# EasyEDA Pro project ProProject_stm32_2023-08-13(1).epro

# Schematic stm32
Create Date: 2023-08-06; Page Name: P1; Project Name: stm32; Schematic Name: stm32; Update Date: 2023-08-10; Company: 嘉立创EDA; Page Size: A4; Version: V1.0
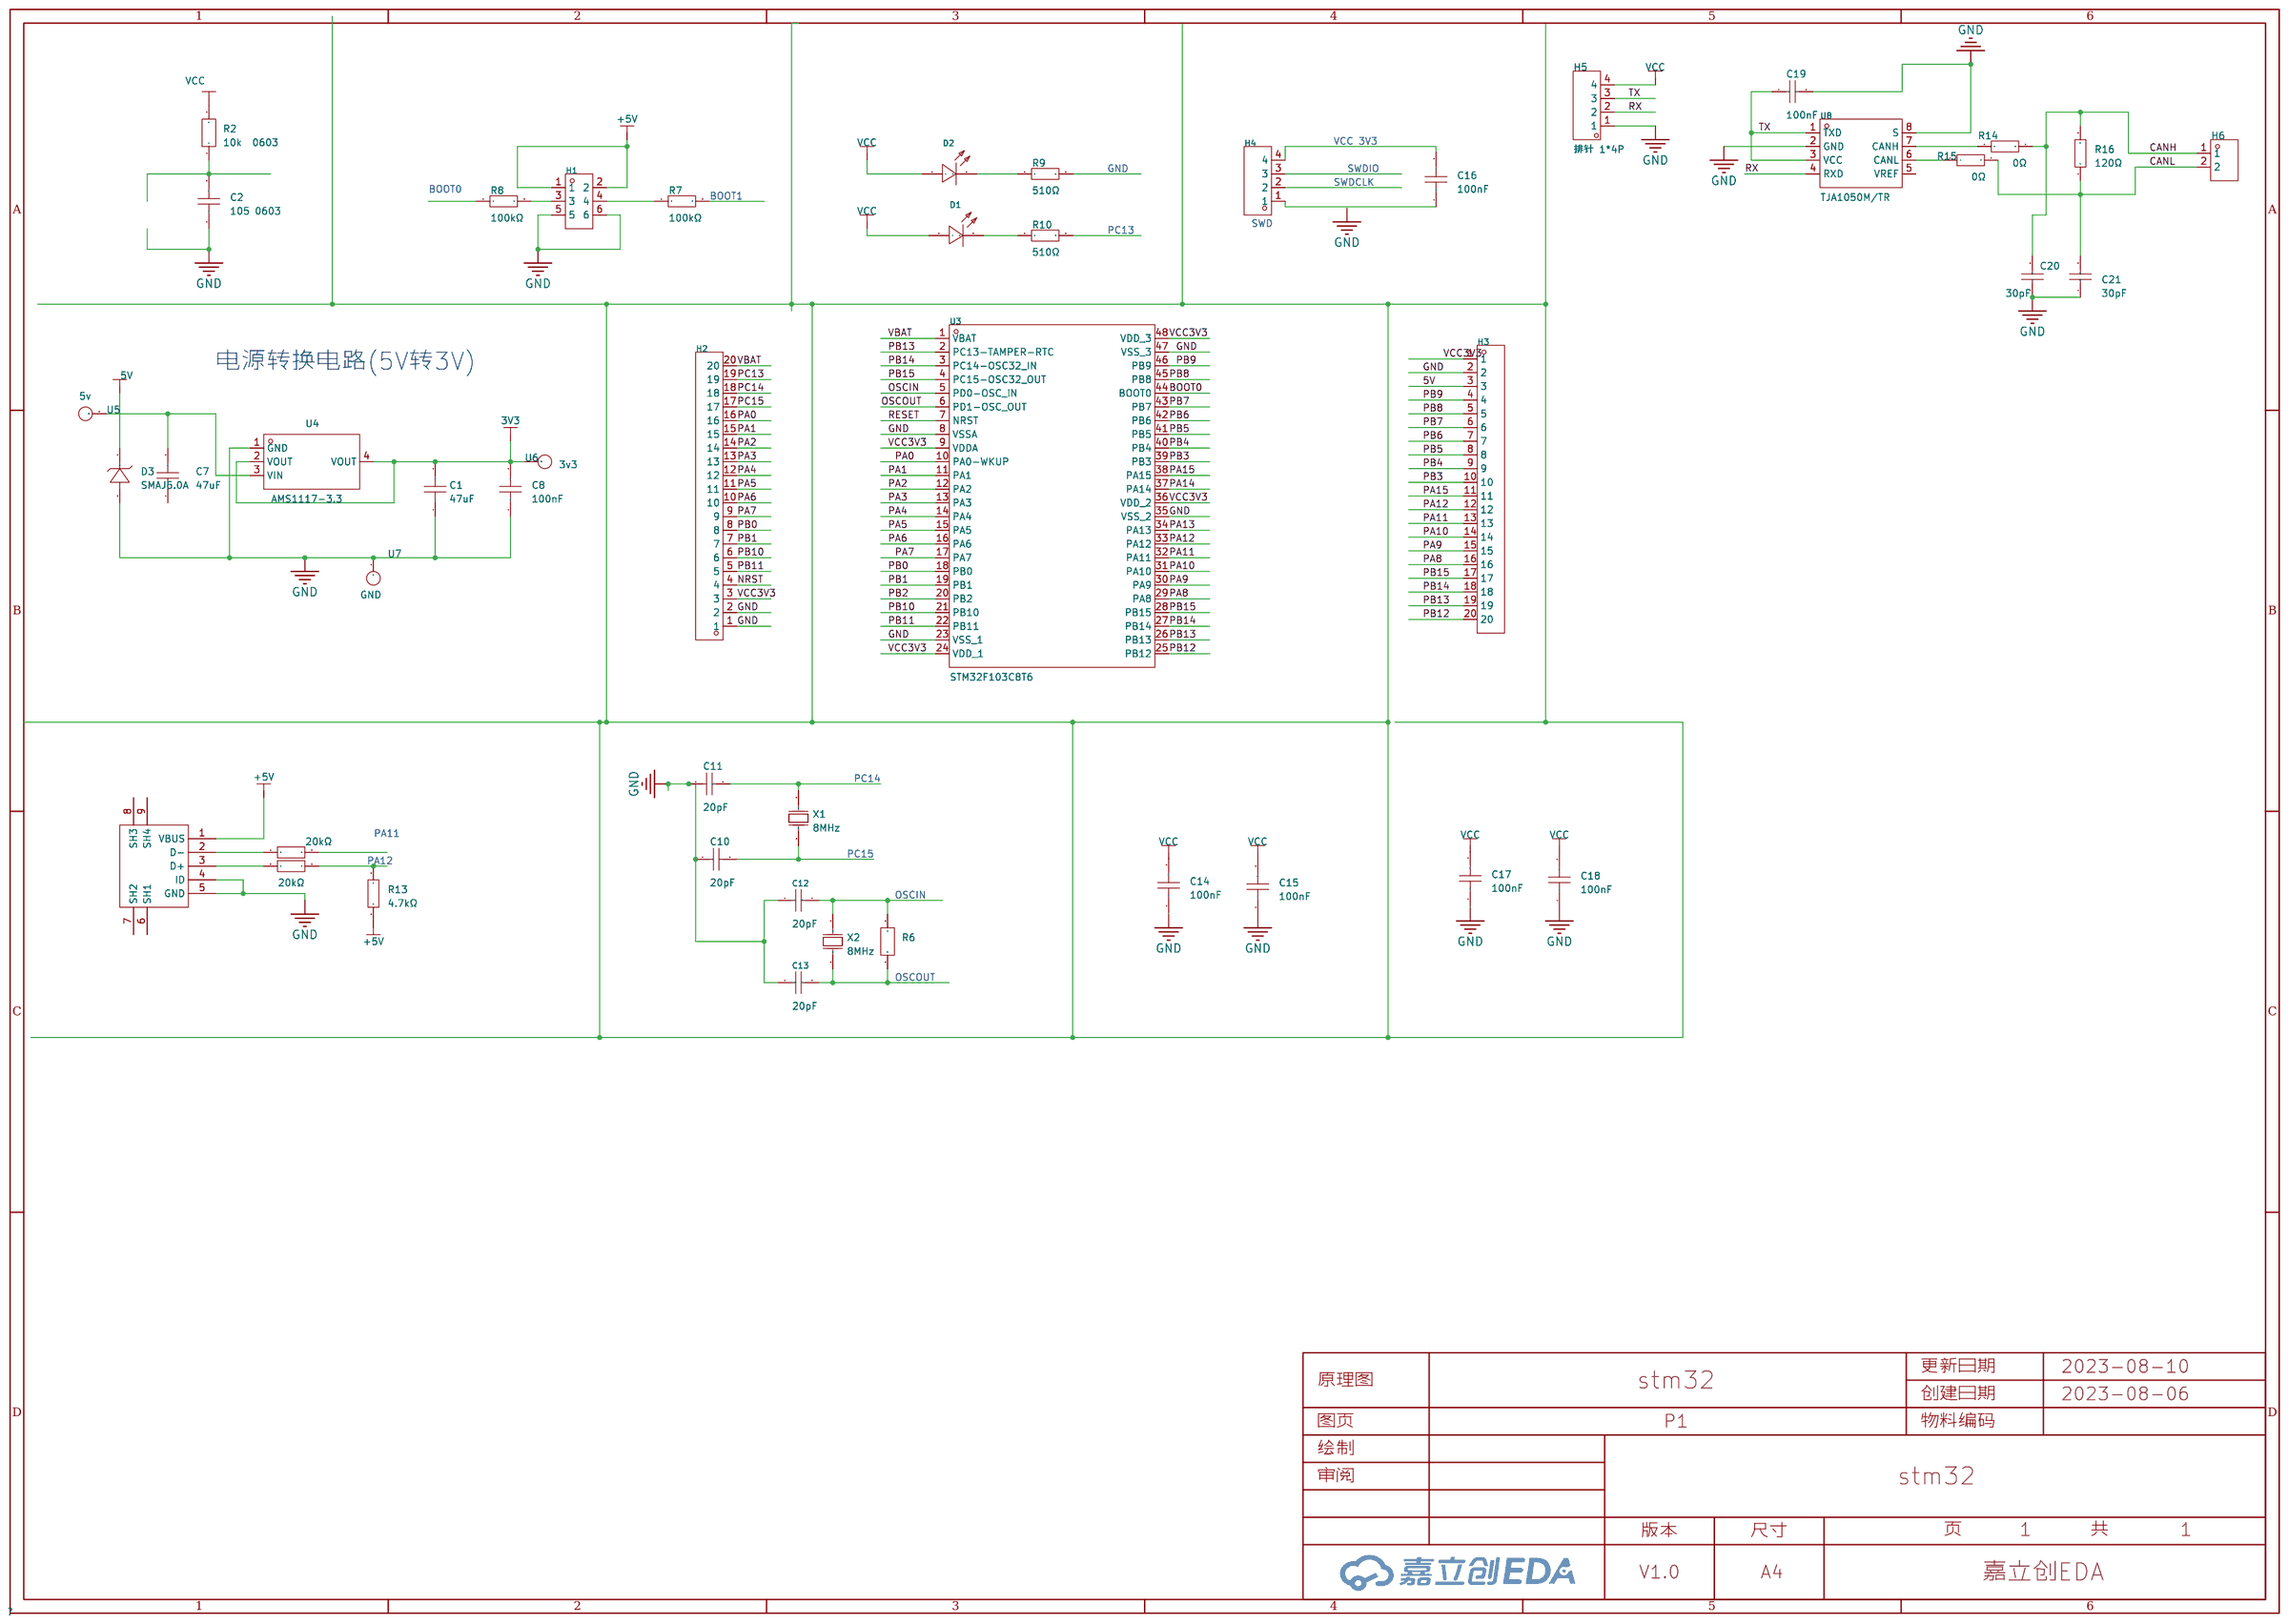
[diagram p0: schematic sheet]

## Parts
C1  47uF  [C1206]
C2  105 0603  [C0603]
C7  47uF  [C1206]
C8  100nF  [C0603]
C10  20pF  [C0603]
C11  20pF  [C0603]
C12  20pF  [C0402]
C13  20pF  [C0402]
C14  100nF  [C0603]
C15  100nF  [C0603]
C16  100nF  [C0603]
C17  100nF  [C0603]
C18  100nF  [C0603]
C19  100nF  [C0603]
C20  30pF  [C0603]
C21  30pF  [C0603]
D1  KT-0805W  [LED0805-R-RD]
D2  KT-0805W  [LED0805-R-RD]
D3  SMAJ5.0A  [SMA_L4.3-W2.6-LS5.0-RD]
H1  双排针2*3P 脚距2.54mm 贴片  [HDR-SMD_6P-P2.54-V-M-R2-C3-S2.54-LS7.4]
H2  PZ200-1-20-Z  [HDR-TH_20P-P2.00-V-M]
H3  PZ200-1-20-Z  [HDR-TH_20P-P2.00-V-M]
H4  PZ200-1-04-Z  [HDR-TH_4P-P2.00-V-M]
H5  排针 1*4P  [HDR-TH_4P-P2.54-V-M]
H6  2.0双塑排针1*2p 总针长11mm两边3+4  [HDR-TH_2P-P2.00-V-M-3]
R2  10k  0603  [R0603]
R6  直插金属膜电阻1MΩ±1%1/2W  [RES-TH_BD3.5-L9.0-P13.00-D0.5]
R7  100kΩ  [R0603]
R8  100kΩ  [R0603]
R9  510Ω  [R0603]
R10  510Ω  [R0603]
R11  20kΩ  [R0603]
R12  20kΩ  [R0603]
R13  4.7kΩ  [R0603]
R14  0Ω  [R0603]
R15  0Ω  [R0603]
R16  120Ω  [R0603]
U3  STM32F103C8T6  [LQFP-48_L7.0-W7.0-P0.50-LS9.0-BL]
U4  AMS1117-3.3  [SOT-223-3_L6.5-W3.4-P2.30-LS7.0-BR]
U5  5v  [测试点0.9mm]
U6  3v3  [测试点0.9mm]
U7  GND  [测试点0.9mm]
U8  TJA1050M/TR  [SOIC-8_L4.9-W3.9-P1.27-LS6.0-BL]
USB1  MicroXNJ  [MICRO-USB-SMD_MICROXNJ]
X1  8MHz  [CRYSTAL-SMD_L11.5-W4.8-LS12.7]
X2  8MHz  [CRYSTAL-SMD_L11.5-W4.8-LS12.7]

## Library data of the parts
C1 C7 = GRM31CR61C476ME44L: 容值:47uF;精度:±20%;额定电压:16V;材质(温度系数):X5R;; LCSC Part Name: 47uF±20%16V; Supplier Part: C385047; Manufacturer: muRata(村田); Supplier Footprint: 1206; JLCPCB Part Class: 扩展库; Datasheet: https://atta.szlcsc.com/upload/public/pdf/source/20190520/C385047_976DAB2B198F62C3FC0888BB9E7F2E96.pdf; Supplier: LCSC; Tolerance: ±20%; Voltage Rated: 16V; Temperature Coefficient: X5R
C2 = CAP_0603: Supplier Footprint: 0603
C8 = CC0603KRX7R9BB104: 容值:100nF;精度:±10%;额定电压:50V;材质(温度系数):X7R;; LCSC Part Name: 100nF±10%50V; Supplier Part: C14663; Manufacturer: YAGEO(国巨); Supplier Footprint: 0603; JLCPCB Part Class: 基础库; Datasheet: https://atta.szlcsc.com/upload/public/pdf/source/20180910/C282072_33301C7F631E79921B82A8DAC6BCC5B3.pdf; Supplier: LCSC; Tolerance: ±10%; Voltage Rated: 50V; Temperature Coefficient: X7R
C10 C11 = CL10C200JB8NNNC: 容值:20pF;精度:±5%;额定电压:50V;材质(温度系数):C0G;; LCSC Part Name: 20pF ±5% 50V; Supplier Part: C1648; Manufacturer: SAMSUNG(三星); Supplier Footprint: 0603; JLCPCB Part Class: 基础库; Datasheet: https://atta.szlcsc.com/upload/public/pdf/source/20160103/1457707686863.pdf; Supplier: LCSC; Tolerance: ±5%; Voltage Rated: 50V; Temperature Coefficient: C0G
C12 C13 = 0402CG200J500NT: 容值:20pF;精度:±5%;额定电压:50V;材质(温度系数):C0G;; LCSC Part Name: 20pF ±5% 50V; Supplier Part: C1554; Manufacturer: FH(风华); Supplier Footprint: 0402; JLCPCB Part Class: 基础库; Datasheet: https://atta.szlcsc.com/upload/public/pdf/source/20200305/C486355_26A10D38EF8C2A5C37091D0039909270.pdf; Supplier: LCSC; Tolerance: ±5%; Voltage Rated: 50V; Temperature Coefficient: C0G
C14-C18 = CC0603KRX7R9BB104: 容值:100nF;精度:±10%;额定电压:50V;材质(温度系数):X7R;; LCSC Part Name: 100nF ±10% 50V; Supplier Part: C14663; Manufacturer: YAGEO(国巨); Supplier Footprint: 0603; JLCPCB Part Class: 基础库; Datasheet: https://atta.szlcsc.com/upload/public/pdf/source/20180910/C282072_33301C7F631E79921B82A8DAC6BCC5B3.pdf; Supplier: LCSC; Tolerance: ±10%; Voltage Rated: 50V; Temperature Coefficient: X7R
C19 = CC0603KRX7R8BB104: 容值:100nF;精度:±10%;额定电压:25V;材质(温度系数):X7R;; LCSC Part Name: 100nF ±10% 25V; Supplier Part: C92490; Manufacturer: YAGEO(国巨); Supplier Footprint: 0603; JLCPCB Part Class: 扩展库; Datasheet: https://atta.szlcsc.com/upload/public/pdf/source/20170105/1483610795587.pdf; Supplier: LCSC; Tolerance: ±10%; Voltage Rated: 25V; Temperature Coefficient: X7R
C20 C21 = 0603CG300J500NT: 容值:30pF;精度:±5%;额定电压:50V;材质(温度系数):C0G;; LCSC Part Name: 30pF ±5% 50V; Supplier Part: C1658; Manufacturer: FH(风华); Supplier Footprint: 0603; JLCPCB Part Class: 基础库; Datasheet: https://atta.szlcsc.com/upload/public/pdf/source/20170923/C1658_1506149307366988446.pdf; Supplier: LCSC; Tolerance: ±5%; Voltage Rated: 50V; Temperature Coefficient: C0G
D1 D2 = KT-0805W: 色温6000K左右; LCSC Part Name: 0805 白灯 高亮; Supplier Part: C34499; Manufacturer: KENTO; Supplier Footprint: 0805; JLCPCB Part Class: 基础库; Datasheet: https://atta.szlcsc.com/upload/public/pdf/source/20221124/DAA20402FFC1FB071B8B6797757426FE.pdf; Supplier: LCSC
D3 = SMAJ5.0A_C908198: 极性:单向;反向截止电压(Vrwm):5V;击穿电压(最小值):6.4V;击穿电压(最大值):7V;反向漏电流(Ir):800μA;峰值脉冲电流(Ipp)@10/1000μs:43.5A;最大钳位电压:9.2V;; LCSC Part Name: 单向Vrwm:5V; Supplier Part: C908198; Manufacturer: FUXINSEMI(富芯森美); Supplier Footprint: SMA(DO-214AC); JLCPCB Part Class: 扩展库; Datasheet: https://atta.szlcsc.com/upload/public/pdf/source/20201023/C908195_37902766E86D5E1EA357B63C628FE5CE.pdf; Supplier: LCSC; Polarity: 单向; Reverse Stand-Off Voltage (Vrwm): 5V; Breakdown Voltage (Min): 6.4V; Breakdown Voltage (Max): 7V; Reverse Leakage Current (Ir): 800μA; Peak Pulse Current (Ipp)@10/1000μs: 43.5A; Maximum Clamping Voltage: 9.2V
H1 = 双排针2*3P 脚距2.54mm 贴片: 排数:双排;总PIN位数:6P;间距:2.54mm;插针结构:-;行距:2.54mm;安装类型:-;圆针/方针:-;额定电流:-;额定电压:-;配合针长度:-;塑高:-;触头材质:-;触头镀层:-;颜色:黑色;; LCSC Part Name: 2.54mm; Supplier Part: C77761; Manufacturer: BOOMELE(博穆精密); Supplier Footprint: SMD,P=2.54mm; JLCPCB Part Class: 扩展库; Supplier: LCSC; Number of Rows: 双排; Number of Pins: 6P; Pitch: 2.54mm; Row Spacing: 2.54mm; Color: 黑色
H2 H3 = PZ200-1-20-Z: 排数:单排;总PIN位数:20P;间距:2mm;插针结构:1x20P;行距:-;安装类型:直插;圆针/方针:方针;额定电流:1.5A;额定电压:-;配合针长度:4mm;塑高:2mm;端接针长度:2.8mm;工作温度范围:-40℃~+105℃;颜色:黑色;; LCSC Part Name: 2mm 1x20P 直插 方针; Supplier Part: C2905966; Manufacturer: HCTL(华灿天禄); Supplier Footprint: 插件,P=2mm; JLCPCB Part Class: 扩展库; Datasheet: https://atta.szlcsc.com/upload/public/pdf/source/20230609/0DA0371628951EEB327252501352EB23.pdf; Supplier: LCSC; Number of Rows: 单排; Number of Pins: 20P; Pitch: 2mm; Pin Structure: 1x20P; Mounting Type: 直插; Circluar Pins/Square Pins: 方针; Current Rating (Max): 1.5A; Length of Mating Pin: 4mm; Insulation Height: 2mm; Length of End Connection Pin: 2.8mm; Operating Temperature Range: -40℃~+105℃; Color: 黑色
H4 = PZ200-1-04-Z: 排数:单排;总PIN位数:4;间距:2mm;插针结构:1x4P;行距:-;安装类型:直插;圆针/方针:方针;额定电流:1.5A;额定电压:-;配合针长度:4mm;塑高:2mm;端接针长度:2.8mm;工作温度范围:-40℃~+105℃;颜色:黑色;; LCSC Part Name: 2mm 1x4P 直插 方针; Supplier Part: C2905950; Manufacturer: HCTL(华灿天禄); Supplier Footprint: 直插,P=2mm; JLCPCB Part Class: 扩展库; Supplier: LCSC; Number of Rows: 单排; Number of Pins: 4; Pitch: 2mm; Pin Structure: 1x4P; Mounting Type: 直插; Circluar Pins/Square Pins: 方针; Current Rating (Max): 1.5A; Length of Mating Pin: 4mm; Insulation Height: 2mm; Length of End Connection Pin: 2.8mm; Operating Temperature Range: -40℃~+105℃; Color: 黑色
H5 = 排针 1*4P: LCSC Part Name: 排针1*4  间距2.54mm; Supplier Part: C59481; Supplier Footprint: Through Hole; JLCPCB Part Class: 扩展库; Supplier: LCSC
H6 = 2.0双塑排针1*2p 总针长11mm两边3+4: Supplier Part: C2935771; Supplier Footprint: TH-2P; JLCPCB Part Class: 扩展库; Datasheet: 2021-12-17/436977W/07cefaefa05846dab2f179590371b8f0/双塑排针.pdf; Supplier: LCSC
R2 = TNPU060310K0AZEN00: 电阻类型:薄膜电阻;阻值:10kΩ;精度:±0.05%;功率:100mW;; LCSC Part Name: 10kΩ ±0.05% 100mW; Supplier Part: C2073738; Manufacturer: VISHAY(威世); Supplier Footprint: 0603; JLCPCB Part Class: 扩展库; Datasheet: https://atta.szlcsc.com/upload/public/pdf/source/20210607/368D46D70FD0A8291112754664578F50.pdf; Supplier: LCSC; Type: 薄膜电阻; Tolerance: ±0.05%; Power(Watts): 100mW; Temperature Coefficient: ±5ppm/℃; Overload Voltage (Max): 75V; Operating Temperature Range: -55℃~+125℃
R6 = 直插金属膜电阻1MΩ±1%1/2W: Supplier Part: C9900021370; Supplier Footprint: RES-TH; JLCPCB Part Class: 扩展库; Datasheet: https://atta.szlcsc.comnull; Supplier: LCSC
R7 R8 = 0603WAF1003T5E: 电阻类型:厚膜电阻;阻值:100kΩ;精度:±1%;功率:100mW;; LCSC Part Name: 100kΩ ±1% 100mW; Supplier Part: C25803; Manufacturer: UNI-ROYAL(厚声); Supplier Footprint: 0603; JLCPCB Part Class: 基础库; Datasheet: https://atta.szlcsc.com/upload/public/pdf/source/20200306/C422600_1E6D84923E4A46A82E41ADD87F860B5C.pdf; Supplier: LCSC; Type: 厚膜电阻; Tolerance: ±1%; Power(Watts): 100mW; Temperature Coefficient: ±100ppm/℃; Overload Voltage (Max): 75V; Operating Temperature Range: -55℃~+155℃
R9 R10 = 0603WAF5100T5E: 电阻类型:厚膜电阻;阻值:510Ω;精度:±1%;功率:100mW;; LCSC Part Name: 510Ω ±1% 100mW; Supplier Part: C23193; Manufacturer: UNI-ROYAL(厚声); Supplier Footprint: 0603; JLCPCB Part Class: 基础库; Datasheet: https://atta.szlcsc.com/upload/public/pdf/source/20200306/C422600_1E6D84923E4A46A82E41ADD87F860B5C.pdf; Supplier: LCSC; Type: 厚膜电阻; Tolerance: ±1%; Power(Watts): 100mW; Temperature Coefficient: ±100ppm/℃; Overload Voltage (Max): 75V; Operating Temperature Range: -55℃~+155℃
R11 R12 = 0603WAF2002T5E: 电阻类型:厚膜电阻;阻值:20kΩ;精度:±1%;功率:100mW;; LCSC Part Name: 20kΩ ±1% 100mW; Supplier Part: C4184; Manufacturer: UNI-ROYAL(厚声); Supplier Footprint: 0603; JLCPCB Part Class: 基础库; Datasheet: https://atta.szlcsc.com/upload/public/pdf/source/20200306/C422600_1E6D84923E4A46A82E41ADD87F860B5C.pdf; Supplier: LCSC; Type: 厚膜电阻; Tolerance: ±1%; Power(Watts): 100mW; Temperature Coefficient: ±100ppm/℃; Overload Voltage (Max): 75V; Operating Temperature Range: -55℃~+155℃
R13 = 0603WAF4701T5E: 电阻类型:厚膜电阻;阻值:4.7kΩ;精度:±1%;功率:100mW;; LCSC Part Name: 4.7kΩ ±1% 100mW; Supplier Part: C23162; Manufacturer: UNI-ROYAL(厚声); Supplier Footprint: 0603; JLCPCB Part Class: 基础库; Datasheet: https://atta.szlcsc.com/upload/public/pdf/source/20200306/C422600_1E6D84923E4A46A82E41ADD87F860B5C.pdf; Supplier: LCSC; Type: 厚膜电阻; Tolerance: ±1%; Power(Watts): 100mW; Temperature Coefficient: ±100ppm/℃; Overload Voltage (Max): 75V; Operating Temperature Range: -55℃~+155℃
R14 R15 = 0603WAF0000T5E: 电阻类型:厚膜电阻;阻值:0Ω;精度:±1%;功率:100mW;; LCSC Part Name: 0Ω ±1% 100mW; Supplier Part: C21189; Manufacturer: UNI-ROYAL(厚声); Supplier Footprint: 0603; JLCPCB Part Class: 基础库; Datasheet: https://atta.szlcsc.com/upload/public/pdf/source/20200306/C422600_1E6D84923E4A46A82E41ADD87F860B5C.pdf; Supplier: LCSC; Type: 厚膜电阻; Tolerance: ±1%; Power(Watts): 100mW; Overload Voltage (Max): 75V; Operating Temperature Range: -55℃~+155℃
R16 = 0603WAF1200T5E: 电阻类型:厚膜电阻;阻值:120Ω;精度:±1%;功率:100mW;; LCSC Part Name: 120Ω ±1% 100mW; Supplier Part: C22787; Manufacturer: UNI-ROYAL(厚声); Supplier Footprint: 0603; JLCPCB Part Class: 基础库; Datasheet: https://atta.szlcsc.com/upload/public/pdf/source/20200306/C422600_1E6D84923E4A46A82E41ADD87F860B5C.pdf; Supplier: LCSC; Type: 厚膜电阻; Tolerance: ±1%; Power(Watts): 100mW; Temperature Coefficient: ±100ppm/℃; Overload Voltage (Max): 75V; Operating Temperature Range: -55℃~+155℃
U3 = STM32F103C8T6: CPU内核:ARM Cortex-M3;CPU最大主频:72MHz;工作电压范围:2V~3.6V;内部振荡器:有;程序 FLASH容量:64K@x8bit;RAM总容量:20KB;EEPROM/数据 FLASH容量:-;GPIO端口数量:37;ADC(单元数/通道数/位数):1@x10ch/12bit;外设/功能/协议栈:看门狗；DMA；看门狗；片载温度传感器;工作温度范围:-40℃~+85℃;; LCSC Part Name: ARM Cortex-M3 72MHz 闪存：64K@x8bit RAM：20KB MSL=3; Supplier Part: C8734; Manufacturer: ST(意法半导体); Supplier Footprint: LQFP-48(7x7); JLCPCB Part Class: 基础库; Supplier: LCSC; CPU Core: ARM Cortex-M3; Maximum Frequency: 72MHz; Supply Voltage Range: 2V~3.6V; Internal Oscillator: 有; Program FLASH Size: 64K@x8bit; RAM Size: 20KB; GPIO Ports Number: 37; ADC (Units/Channels/bits): 1@x10ch/12bit; Peripherals / Functions / Protocol Stacks: 看门狗；DMA；看门狗；片载温度传感器; Operating Temperature Range: -40℃~+85℃
U4 = AMS1117-3.3_C6186: 输出类型:固定;输出极性:正;最大输入电压:-;输出电压:3.3V;输出电流:1A;电源纹波抑制比(PSRR):72dB@(120Hz);; LCSC Part Name: 输出3.3V1A; Supplier Part: C6186; Manufacturer: AMS; Supplier Footprint: SOT-223; JLCPCB Part Class: 基础库; Datasheet: https://atta.szlcsc.com/upload/public/pdf/source/20180727/C6186_7A095716F0823C02F1997A905E26C086.pdf; Supplier: LCSC; Output Type: 固定; Output Polarity: 正; Number of Outputs: 1; Output Voltage: 3.3V; Dropout Voltage: 1.3V@(800mA); Output Current: 1A; Power Supply Rejection Ratio (PSRR): 72dB@(120Hz)
U5-U7 = 测试点0.9mm: _: 3
U8 = TJA1050M/TR: CAN芯片  1Mbps 5V供电，110节点，高速总线接收器; LCSC Part Name: TJA1050M/TR 停产; Supplier Part: C7432164; Manufacturer: HGSEMI(华冠); Supplier Footprint: SOP-8; Supplier: LCSC
USB1 = MicroXNJ: 连接器类型:Micro-B;标准:USB 2.0;公母:母座;触点数量:5P;端口数量:1;安装方式:卧贴;额定电流 - 电源:1A;工作温度范围:-20℃~+85℃;; LCSC Part Name: Micro-B 母座 卧贴 小牛角有柱 卷边 编带; Supplier Part: C404969; Manufacturer: SHOU HAN(首韩); Supplier Footprint: SMD; JLCPCB Part Class: 扩展库; Datasheet: https://atta.szlcsc.com/upload/public/pdf/source/20220415/2494EDFF499AF6F852F7C820374B6AF3.pdf; Supplier: LCSC; Connector Type: Micro-B; Standard: USB 2.0; Gender: 母座; Number of Contacts: 5P; Number of Ports: 1; Mounting Style: 卧贴; Current Rating - Power (Max): 1A; Operating Temperature Range: -20℃~+85℃
X1 X2 = X49SM8MSD2SC: 频率:8MHz;频率公差:±20ppm;负载电容:20pF;; LCSC Part Name: 8MHz ±20ppm 20pF HC-49SMD; Supplier Part: C12674; Manufacturer: YXC(扬兴晶振); Supplier Footprint: HC-49S-SMD; JLCPCB Part Class: 基础库; Datasheet: https://atta.szlcsc.com/upload/public/pdf/source/20210329/C106809_0E91E60850A780B284B63D653DC40EA4.pdf; Supplier: LCSC; Crystal Type: 49SMD; Frequency Tolerance: ±20ppm; Frequency Stability: ±30ppm; Load Capacitance: 20pF; Operating Temperature: -20℃~+70℃

## Nets
3V3: C1.2 C8.2 U4.2(VOUT) U4.4(VOUT) U6.1(Pin1)
5V: D3.1(C) H3.3
+5V: H1.1 H1.2 R13.1 USB1.1(VBUS)
GND: C1.1 C2.1 C8.1 C10.1 C11.1 C12.1 C13.1 C14.1 C15.1 C17.1 C18.1 C19.2 C20.1 C21.1 D3.2(A) H1.5 H1.6 H2.1 H2.2 H3.2 H5.1 U3.8(VSSA) U3.23(VSS_1) U3.35(VSS_2) U3.47(VSS_3) U4.1(GND) U7.1(Pin1) U8.2(GND) U8.8(S) USB1.4(ID) USB1.5(GND)
VBAT: H2.20 U3.1(VBAT)
VCC: C14.2 C15.2 C17.2 C18.2 D1.1(A) D2.1(A) H5.4 R2.2
VCC3V3: H2.3 H3.1 U3.9(VDDA) U3.24(VDD_1) U3.36(VDD_2) U3.48(VDD_3)
BOOT0: U3.44(BOOT0)
CANH: C20.2 H6.1 R14.2 R16.2
CANL: C21.2 H6.2 R15.2 R16.1
NRST: H2.4
OSCIN: U3.5(PD0-OSC_IN)
OSCOUT: U3.6(PD1-OSC_OUT)
PA0: H2.16 U3.10(PA0-WKUP)
PA1: H2.15 U3.11(PA1)
PA2: H2.14 U3.12(PA2)
PA3: H2.13 U3.13(PA3)
PA4: H2.12 U3.14(PA4)
PA5: H2.11 U3.15(PA5)
PA6: H2.10 U3.16(PA6)
PA7: H2.9 U3.17(PA7)
PA8: H3.16 U3.29(PA8)
PA9: H3.15 U3.30(PA9)
PA10: H3.14 U3.31(PA10)
PA11: H3.13 U3.32(PA11)
PA12: H3.12 U3.33(PA12)
PA13: U3.34(PA13)
PA14: U3.37(PA14)
PA15: H3.11 U3.38(PA15)
PB0: H2.8 U3.18(PB0)
PB1: H2.7 U3.19(PB1)
PB2: U3.20(PB2)
PB3: H3.10 U3.39(PB3)
PB4: H3.9 U3.40(PB4)
PB5: H3.8 U3.41(PB5)
PB6: H3.7 U3.42(PB6)
PB7: H3.6 U3.43(PB7)
PB8: H3.5 U3.45(PB8)
PB9: H3.4 U3.46(PB9)
PB10: H2.6 U3.21(PB10)
PB11: H2.5 U3.22(PB11)
PB12: H3.20 U3.25(PB12)
PB13: H3.19 U3.2(PC13-TAMPER-RTC) U3.26(PB13)
PB14: H3.18 U3.3(PC14-OSC32_IN) U3.27(PB14)
PB15: H3.17 U3.4(PC15-OSC32_OUT) U3.28(PB15)
PC13: H2.19
PC14: H2.18
PC15: H2.17
RESET: U3.7(NRST)
RX: H5.2 U8.4(RXD)
TX: C19.1 H5.3 U8.1(TXD) U8.3(VCC)
Net-(C2-2): C2.2 R2.1
Net-(C7-2): C7.2 U4.3(VIN) U5.1(Pin1)
Net-(C10-2): C10.2 X1.2(OSC2)
Net-(C11-2): C11.2 X1.1(OSC1)
Net-(C12-2): C12.2 R6.2 X2.1(OSC1)
Net-(C13-2): C13.2 R6.1 X2.2(OSC2)
Net-(C16-1): C16.1 H4.1
Net-(C16-2): C16.2 H4.4
Net-(D1-2): D1.2(K) R10.1
Net-(D2-2): D2.2(K) R9.1
Net-(H1-3): H1.3 R8.2
Net-(H1-4): H1.4 R7.1
Net-(R11-1): R11.1 USB1.2(D-)
Net-(R12-1): R12.1 USB1.3(D+)
Net-(R12-2): R12.2 R13.2
Net-(R14-1): R14.1 U8.7(CANH)
Net-(R15-1): R15.1 U8.6(CANL)

Not connected (* = marked no-connect by the designer): C7 1; H4 2 3; R7 2; R8 1; R9 2; R10 2; R11 2; U8 5(VREF); USB1 6(SH1) 7(SH2) 8(SH3) 9(SH4)

## Notes on the sheet
- VCC 3V3
- GND
- SWDIO
- BOOT0
- SWDCLK
- BOOT1
- PC13
- SWD
- 电源转换电路(5V转3V)
- PC14
- PA11
- PC15
- PA12
- OSCIN
- OSCOUT
